# EAGLE board PT08ttl (EAGLE 6.6.0)
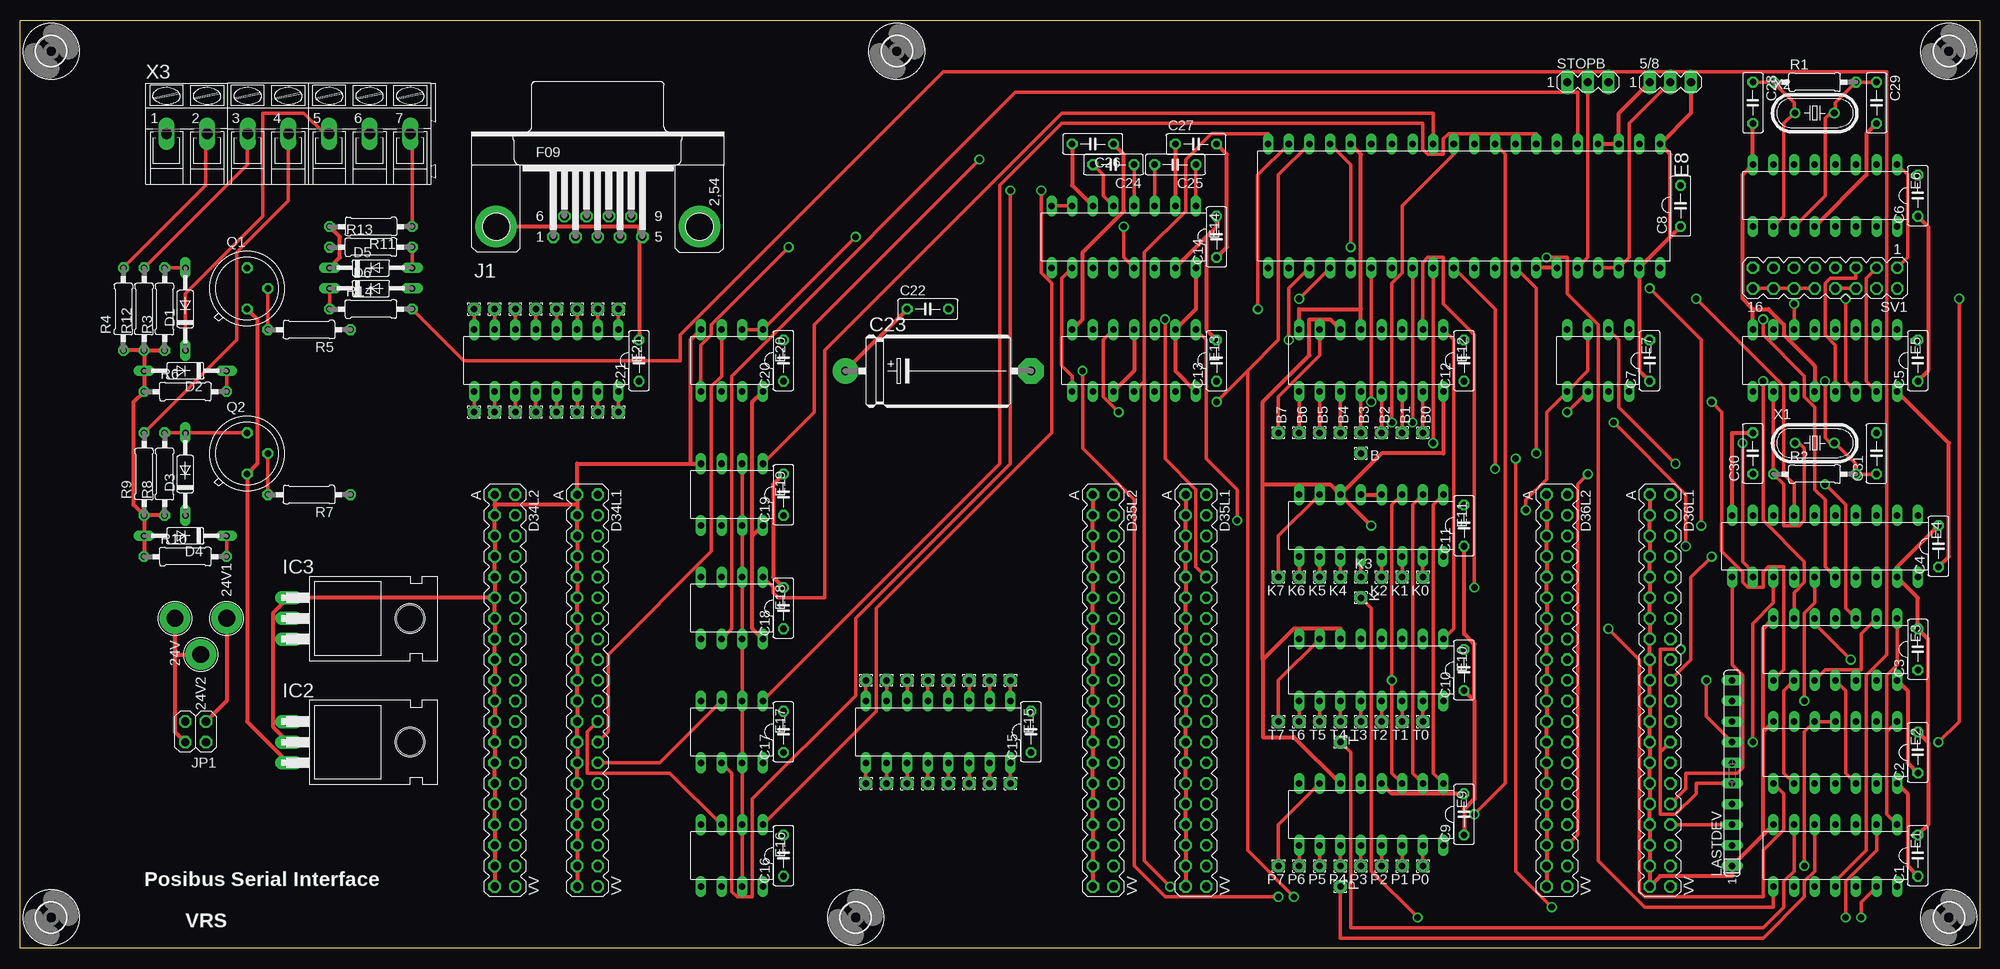
[diagram p3: board, top side]
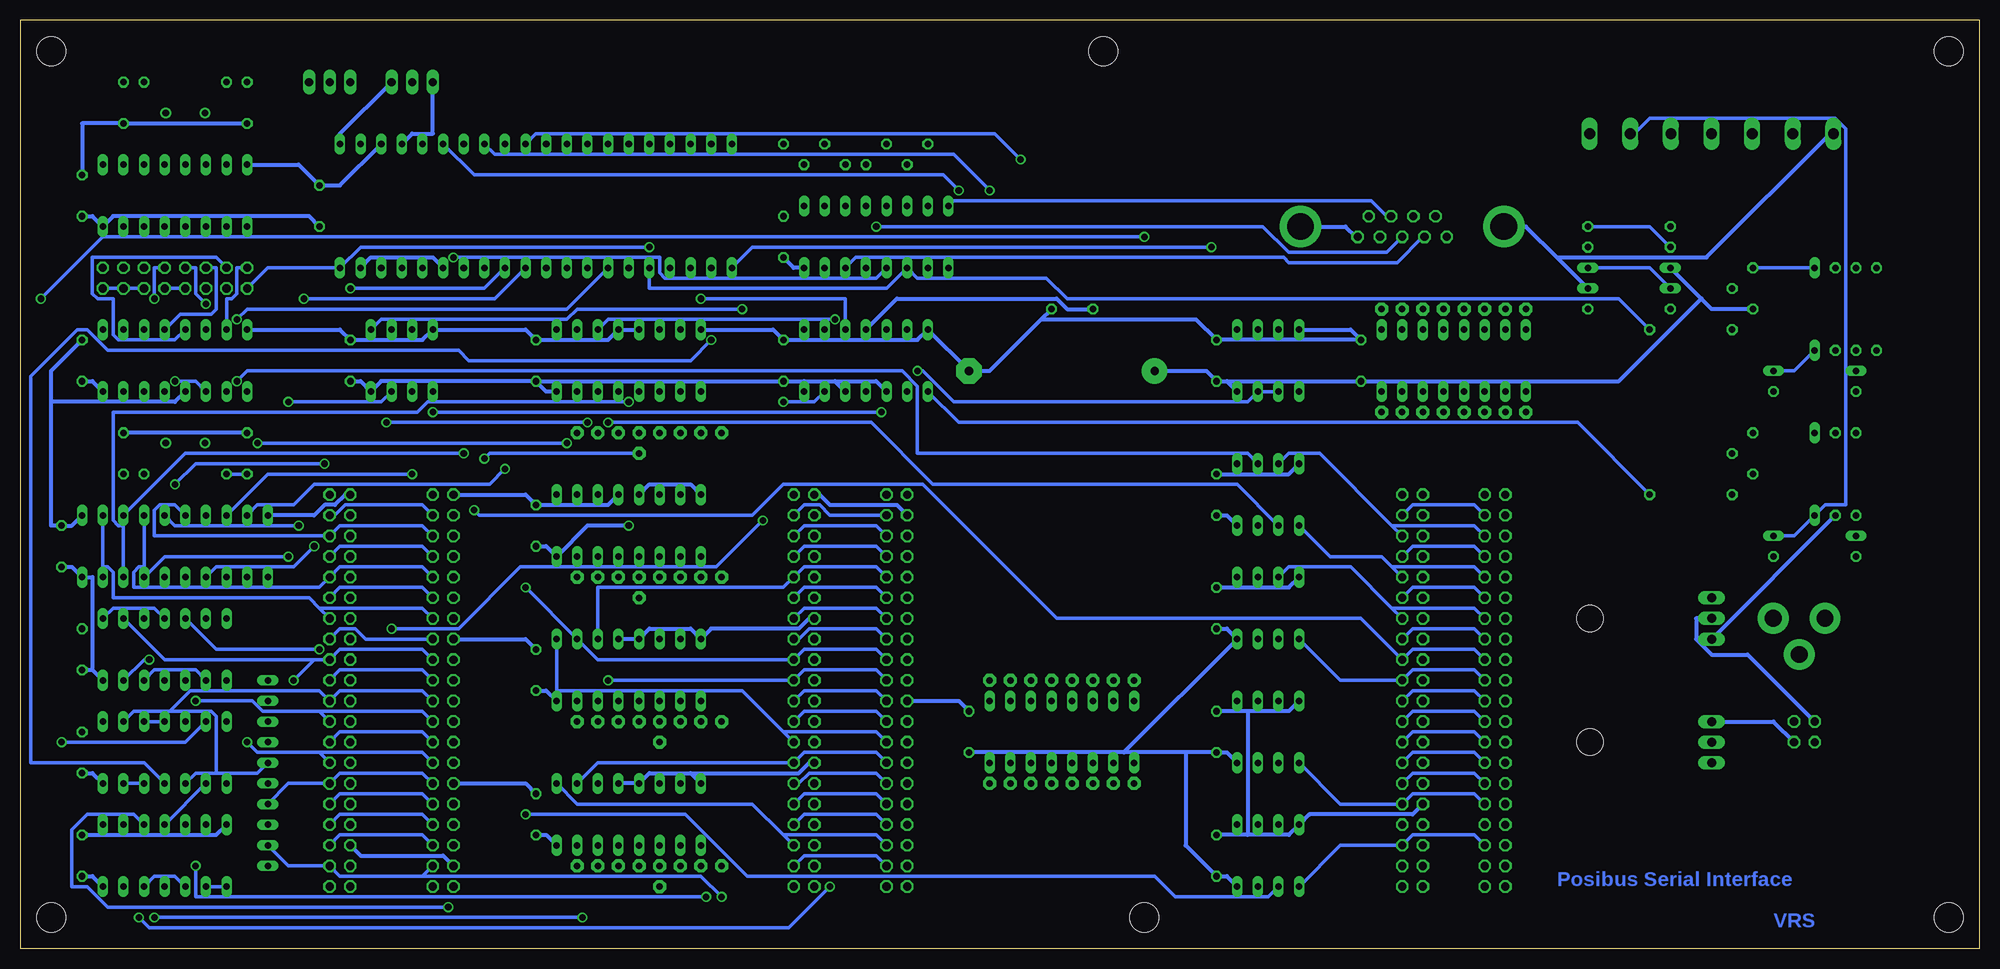
[diagram p4: board, bottom side, seen from below]

Size 241.3 x 114.3 mm. Coordinates in mm from the lower left corner, seen from the top.
Outline: 0,0 0,114.3 241.3,114.3 241.3,0 0,0
Copper layers (1+16): Top 0.035mm / dielectric 1.5mm / Bottom 0.035mm
Design rules "16mils": minimum track width 16mil, minimum drill 32mil, track to track 15mil, track to pad 10mil, pad to pad 10mil, via to via 10mil, smd to smd 10mil, copper to edge 13mil, drill to drill 10mil, minimum pad ring 10mil, minimum via ring 8mil, stop-mask expansion 0mil, vias tented up to drill 0mil, thermal gap 10mil
Net classes: 1 supply: width 0.508 mm

## Footprints (pad centres in the part's own frame; a part is rotated, then mirrored left to right if it is on the bottom)
MA03-1 = drill 1.016 long: 1 -2.54,0; 2 0,0; 3 2.54,0
0820 = drill 2.083 pad 3.81: P$1 0,0
1,6/0,8 = drill 0.813 pad 1.6 octagon: 1 0,0
C050-025X075 = drill 0.813 octagon: 1 -2.54,0; 2 2.54,0
E22-9 = drill 1.016 pad 3.15: + -11.43,0 | drill 1.016 pad 3.15 octagon: - 11.43,0
DO35-10 = drill 0.813 long: A 5.08,0; C -5.08,0
DEC40PINV = drill 1.016 octagon: A -24.13,-1.27; AA 3.81,-1.27; B -24.13,1.27; BB 3.81,1.27; C -21.59,-1.27; CC 6.35,-1.27; D -21.59,1.27; DD 6.35,1.27; E -19.05,-1.27; EE 8.89,-1.27; F -19.05,1.27; FF 8.89,1.27; H -16.51,-1.27; HH 11.43,-1.27; J -16.51,1.27; JJ 11.43,1.27; K -13.97,-1.27; KK 13.97,-1.27; L -13.97,1.27; LL 13.97,1.27; M -11.43,-1.27; MM 16.51,-1.27; N -11.43,1.27; NN 16.51,1.27; P -8.89,-1.27; PP 19.05,-1.27; R -8.89,1.27; RR 19.05,1.27; S -6.35,-1.27; SS 21.59,-1.27; T -6.35,1.27; TT 21.59,1.27; U -3.81,-1.27; UU 24.13,-1.27; V -3.81,1.27; VV 24.13,1.27; W -1.27,-1.27; X -1.27,1.27; Y 1.27,-1.27; Z 1.27,1.27
DIL14 = drill 0.813 long: 1 -7.62,-3.81; 2 -5.08,-3.81; 3 -2.54,-3.81; 4 0,-3.81; 5 2.54,-3.81; 6 5.08,-3.81; 7 7.62,-3.81; 8 7.62,3.81; 9 5.08,3.81; 10 2.54,3.81; 11 0,3.81; 12 -2.54,3.81; 13 -5.08,3.81; 14 -7.62,3.81
DIL20 = drill 0.813 long: 1 -11.43,-3.81; 2 -8.89,-3.81; 3 -6.35,-3.81; 4 -3.81,-3.81; 5 -1.27,-3.81; 6 1.27,-3.81; 7 3.81,-3.81; 8 6.35,-3.81; 9 8.89,-3.81; 10 11.43,-3.81; 11 11.43,3.81; 12 8.89,3.81; 13 6.35,3.81; 14 3.81,3.81; 15 1.27,3.81; 16 -1.27,3.81; 17 -3.81,3.81; 18 -6.35,3.81; 19 -8.89,3.81; 20 -11.43,3.81
DIL16 = drill 0.813 long: 1 -8.89,-3.81; 2 -6.35,-3.81; 3 -3.81,-3.81; 4 -1.27,-3.81; 5 1.27,-3.81; 6 3.81,-3.81; 7 6.35,-3.81; 8 8.89,-3.81; 9 8.89,3.81; 10 6.35,3.81; 11 3.81,3.81; 12 1.27,3.81; 13 -1.27,3.81; 14 -3.81,3.81; 15 -6.35,3.81; 16 -8.89,3.81
DIL08 = drill 0.813 long: 1 -3.81,-3.81; 2 -1.27,-3.81; 3 1.27,-3.81; 4 3.81,-3.81; 5 3.81,3.81; 6 1.27,3.81; 7 -1.27,3.81; 8 -3.81,3.81
DIL40 = drill 0.813 long: 1 -24.13,-7.62; 2 -21.59,-7.62; 3 -19.05,-7.62; 4 -16.51,-7.62; 5 -13.97,-7.62; 6 -11.43,-7.62; 7 -8.89,-7.62; 8 -6.35,-7.62; 9 -3.81,-7.62; 10 -1.27,-7.62; 11 1.27,-7.62; 12 3.81,-7.62; 13 6.35,-7.62; 14 8.89,-7.62; 15 11.43,-7.62; 16 13.97,-7.62; 17 16.51,-7.62; 18 19.05,-7.62; 19 21.59,-7.62; 20 24.13,-7.62; 21 24.13,7.62; 22 21.59,7.62; 23 19.05,7.62; 24 16.51,7.62; 25 13.97,7.62; 26 11.43,7.62; 27 8.89,7.62; 28 6.35,7.62; 29 3.81,7.62; 30 1.27,7.62; 31 -1.27,7.62; 32 -3.81,7.62; 33 -6.35,7.62; 34 -8.89,7.62; 35 -11.43,7.62; 36 -13.97,7.62; 37 -16.51,7.62; 38 -19.05,7.62; 39 -21.59,7.62; 40 -24.13,7.62
TO220H = drill 1.118 long: 1 -2.54,-10.16; 2 0,-10.16; 3 2.54,-10.16 | hole 3.302: 0,4.826
F09HP = drill 1.016 octagon: 1 -5.486,-1.27; 2 -2.743,-1.27; 3 0,-1.27; 4 2.743,-1.27; 5 5.486,-1.27; 6 -4.115,1.27; 7 -1.372,1.27; 8 1.372,1.27; 9 4.115,1.27 | drill 3.302 pad 5.08: G1 -12.522,0; G2 12.522,0
2X02 = drill 1.016 octagon: 1 -1.27,-1.27; 2 -1.27,1.27; 3 1.27,-1.27; 4 1.27,1.27
SIL10 = drill 0.813 long: 1 -11.43,0; 2 -8.89,0; 3 -6.35,0; 4 -3.81,0; 5 -1.27,0; 6 1.27,0; 7 3.81,0; 8 6.35,0; 9 8.89,0; 10 11.43,0
TO39 = drill 0.813 octagon: 1 0,-2.54; 2 2.54,0; 3 0,2.54
0207/10 = drill 0.813 octagon: 1 -5.08,0; 2 5.08,0
MA08-2 = drill 1.016 octagon: 1 -8.89,-1.27; 2 -8.89,1.27; 3 -6.35,-1.27; 4 -6.35,1.27; 5 -3.81,-1.27; 6 -3.81,1.27; 7 -1.27,-1.27; 8 -1.27,1.27; 9 1.27,-1.27; 10 1.27,1.27; 11 3.81,-1.27; 12 3.81,1.27; 13 6.35,-1.27; 14 6.35,1.27; 15 8.89,-1.27; 16 8.89,1.27
3,6 = hole 3.6: 0,0
HC49U-V = drill 0.813: 1 -2.413,0; 2 2.413,0
AK300/7 = drill 1.321 long: 1 -15.011,0; 2 -10.008,0; 3 -5.004,0; 4 0,0; 5 5.004,0; 6 10.008,0; 7 15.011,0

## Placement (x,y rotation side)
5/8  [MA03-1]  203.2,106.68 0 top
24V  PAD-0820  [0820]  19.05,40.64 270 top
24V1  PAD-0820  [0820]  25.4,40.64 90 top
24V2  PAD-0820  [0820]  22.23,36.2 270 top
B  [1,6/0,8]  165.1,60.96 270 top
B0  [1,6/0,8]  172.72,63.5 270 top
B1  [1,6/0,8]  170.18,63.5 270 top
B2  [1,6/0,8]  167.64,63.5 270 top
B3  [1,6/0,8]  165.1,63.5 270 top
B4  [1,6/0,8]  162.56,63.5 270 top
B5  [1,6/0,8]  160.02,63.5 270 top
B6  [1,6/0,8]  157.48,63.5 270 top
B7  [1,6/0,8]  154.94,63.5 270 top
C1  0.1  [C050-025X075]  233.68,11.43 90 top
C2  0.1  [C050-025X075]  233.68,24.13 90 top
C3  0.1  [C050-025X075]  233.68,36.83 90 top
C4  0.1  [C050-025X075]  236.22,49.53 90 top
C5  0.1  [C050-025X075]  233.68,72.39 90 top
C6  0.1  [C050-025X075]  233.68,92.71 90 top
C7  0.1  [C050-025X075]  200.66,72.39 90 top
C8  0.1  [C050-025X075]  204.47,91.44 90 top
C9  0.1  [C050-025X075]  177.8,16.51 90 top
C10  0.1  [C050-025X075]  177.8,34.29 90 top
C11  0.1  [C050-025X075]  177.8,52.07 90 top
C12  0.1  [C050-025X075]  177.8,72.39 90 top
C13  0.1  [C050-025X075]  147.32,72.39 90 top
C14  0.1  [C050-025X075]  147.32,87.63 90 top
C15  0.1  [C050-025X075]  124.46,26.67 90 top
C16  0.1  [C050-025X075]  93.98,11.43 90 top
C17  0.1  [C050-025X075]  93.98,26.67 90 top
C18  0.1  [C050-025X075]  93.98,41.91 90 top
C19  0.1  [C050-025X075]  93.98,55.88 90 top
C20  0.1  [C050-025X075]  93.98,72.39 90 top
C21  0.1  [C050-025X075]  76.2,72.39 90 top
C22  0.1  [C050-025X075]  111.76,78.74 0 top
C23  100uf  [E22-9]  113.03,71.12 0 top
C24  0.1  [C050-025X075]  134.62,96.52 180 top
C25  0.1  [C050-025X075]  142.24,96.52 180 top
C26  0.1  [C050-025X075]  132.08,99.06 180 top
C27  0.1  [C050-025X075]  144.78,99.06 0 top
C28  22pf  [C050-025X075]  213.36,104.14 270 top
C29  22pf  [C050-025X075]  228.6,104.14 270 top
C30  22pf  [C050-025X075]  213.36,60.96 90 top
C31  22pf  [C050-025X075]  228.6,60.96 90 top
D1  D664  [DO35-10]  20.32,78.74 90 top
D2  D664  [DO35-10]  20.32,71.12 180 top
D3  D664  [DO35-10]  20.32,58.42 90 top
D4  D664  [DO35-10]  20.32,50.8 180 top
D5  D664  [DO35-10]  43.18,83.82 0 top
D6  D664  [DO35-10]  43.18,81.28 0 top
D34L1  [DEC40PINV]  69.85,31.75 270 top
D34L2  [DEC40PINV]  59.69,31.75 270 top
D35L1  [DEC40PINV]  144.78,31.75 270 top
D35L2  [DEC40PINV]  133.35,31.75 270 top
D36L1  [DEC40PINV]  201.93,31.75 270 top
D36L2  [DEC40PINV]  189.23,31.75 270 top
E1  74LS02N  [DIL14]  223.52,11.43 180 top
E2  74LS00N  [DIL14]  223.52,24.13 180 top
E3  74LS08N  [DIL14]  223.52,36.83 180 top
E4  74LS240N  [DIL20]  222.25,49.53 180 top
E5  74HCT4060N  [DIL16]  222.25,72.39 180 top
E6  74HCT4060N  [DIL16]  222.25,92.71 180 top
E7  DS75452N  [DIL08]  194.31,72.39 180 top
E8  HD6402  [DIL40]  177.8,91.44 180 top
E9  74LS138N  [DIL16]  166.37,16.51 180 top
E10  74LS138N  [DIL16]  166.37,34.29 180 top
E11  74LS138N  [DIL16]  166.37,52.07 180 top
E12  74LS138N  [DIL16]  166.37,72.39 180 top
E13  74LS74N  [DIL14]  137.16,72.39 180 top
E14  MAX232  [DIL16]  135.89,87.63 180 top
E15  SPARE  [DIL16]  113.03,26.67 180 top
E16  DS75452N  [DIL08]  87.63,11.43 180 top
E17  DS75452N  [DIL08]  87.63,26.67 180 top
E18  DS75452N  [DIL08]  87.63,41.91 180 top
E19  DS75452N  [DIL08]  87.63,55.88 180 top
E20  DS75452N  [DIL08]  87.63,72.39 180 top
E21  SPARE  [DIL16]  64.77,72.39 180 top
IC2  7805T  [TO220H]  43.18,25.4 270 top
IC3  7915T  [TO220H]  43.18,40.64 270 top
J1  [F09HP]  71.12,88.9 0 top
JP1  [2X02]  21.59,26.67 180 top
K  [1,6/0,8]  165.1,43.18 270 top
K0  [1,6/0,8]  172.72,45.72 180 top
K1  [1,6/0,8]  170.18,45.72 180 top
K2  [1,6/0,8]  167.64,45.72 180 top
K3  [1,6/0,8]  165.1,45.72 0 top
K4  [1,6/0,8]  162.56,45.72 180 top
K5  [1,6/0,8]  160.02,45.72 180 top
K6  [1,6/0,8]  157.48,45.72 180 top
K7  [1,6/0,8]  154.94,45.72 180 top
LASTDEV  100  [SIL10]  210.82,21.59 90 top
P  [1,6/0,8]  162.56,7.62 270 top
P0  [1,6/0,8]  172.72,10.16 180 top
P1  [1,6/0,8]  170.18,10.16 180 top
P2  [1,6/0,8]  167.64,10.16 180 top
P3  [1,6/0,8]  165.1,10.16 180 top
P4  [1,6/0,8]  162.56,10.16 180 top
P5  [1,6/0,8]  160.02,10.16 180 top
P6  [1,6/0,8]  157.48,10.16 180 top
P7  [1,6/0,8]  154.94,10.16 180 top
PAD1  [1,6/0,8]  121.92,33.02 180 top
PAD2  [1,6/0,8]  119.38,33.02 180 top
PAD3  [1,6/0,8]  116.84,33.02 180 top
PAD4  [1,6/0,8]  114.3,33.02 180 top
PAD5  [1,6/0,8]  111.76,33.02 180 top
PAD6  [1,6/0,8]  109.22,33.02 180 top
PAD7  [1,6/0,8]  106.68,33.02 180 top
PAD8  [1,6/0,8]  104.14,33.02 180 top
PAD9  [1,6/0,8]  121.92,20.32 180 top
PAD18  [1,6/0,8]  73.66,78.74 180 top
PAD19  [1,6/0,8]  71.12,78.74 180 top
PAD28  [1,6/0,8]  68.58,78.74 180 top
PAD29  [1,6/0,8]  66.04,78.74 180 top
PAD30  [1,6/0,8]  63.5,78.74 180 top
PAD31  [1,6/0,8]  60.96,78.74 180 top
PAD32  [1,6/0,8]  58.42,78.74 180 top
PAD33  [1,6/0,8]  55.88,78.74 180 top
PAD34  [1,6/0,8]  73.66,66.04 180 top
PAD35  [1,6/0,8]  71.12,66.04 180 top
PAD36  [1,6/0,8]  68.58,66.04 180 top
PAD37  [1,6/0,8]  66.04,66.04 180 top
PAD38  [1,6/0,8]  63.5,66.04 180 top
PAD39  [1,6/0,8]  60.96,66.04 180 top
PAD40  [1,6/0,8]  58.42,66.04 180 top
PAD41  [1,6/0,8]  55.88,66.04 180 top
PAD42  [1,6/0,8]  119.38,20.32 180 top
PAD43  [1,6/0,8]  116.84,20.32 180 top
PAD44  [1,6/0,8]  114.3,20.32 180 top
PAD45  [1,6/0,8]  111.76,20.32 180 top
PAD46  [1,6/0,8]  109.22,20.32 180 top
PAD47  [1,6/0,8]  106.68,20.32 180 top
PAD48  [1,6/0,8]  104.14,20.32 180 top
Q1  2N2904  [TO39]  27.94,81.28 0 top
Q2  2N2904  [TO39]  27.94,60.96 0 top
R1  10M  [0207/10]  220.98,106.68 0 top
R2  10M  [0207/10]  220.98,58.42 0 top
R3  1.5K 1/2W  [0207/10]  17.78,78.74 90 top
R4  750 1W  [0207/10]  12.7,78.74 90 top
R5  470  [0207/10]  35.56,76.2 180 top
R6  15K 1/2W  [0207/10]  20.32,68.58 0 top
R7  470  [0207/10]  35.56,55.88 180 top
R8  1.5K 1/2W  [0207/10]  17.78,58.42 90 top
R9  750 1W  [0207/10]  15.24,58.42 90 top
R10  15K 1/2W  [0207/10]  20.32,48.26 0 top
R11  750 1/2W  [0207/10]  43.18,88.9 180 top
R12  560 1/2W  [0207/10]  15.24,78.74 90 top
R13  82  [0207/10]  43.18,86.36 0 top
R14  3.3K  [0207/10]  43.18,78.74 0 top
STOPB  [MA03-1]  193.04,106.68 0 top
SV1  [MA08-2]  222.25,82.55 180 top
T  [1,6/0,8]  162.56,25.4 270 top
T0  [1,6/0,8]  172.72,27.94 180 top
T1  [1,6/0,8]  170.18,27.94 180 top
T2  [1,6/0,8]  167.64,27.94 180 top
T3  [1,6/0,8]  165.1,27.94 180 top
T4  [1,6/0,8]  162.56,27.94 180 top
T5  [1,6/0,8]  160.02,27.94 180 top
T6  [1,6/0,8]  157.48,27.94 180 top
T7  [1,6/0,8]  154.94,27.94 180 top
U$1  [3,6]  237.49,3.81 0 top
U$2  [3,6]  237.49,110.49 0 top
U$3  [3,6]  3.81,110.49 0 top
U$4  [3,6]  3.81,3.81 0 top
U$5  [3,6]  107.95,110.49 0 top
U$6  [3,6]  102.87,3.81 0 top
X1  2.4576Mhz  [HC49U-V]  220.98,62.23 0 top
X2  3.579545Mhz  [HC49U-V]  220.98,102.87 0 top
X3  [AK300/7]  33.02,100.33 0 top

## Tracks (layer width: path | path; a pad name or v marks a point on that pad's centre or on a via)
24V1
  Top 0.508: JP1.1 25.4,30.48 24V1.P$1
24V2
  Top 0.508: JP1.4 19.05,26.67 19.05,36.2 | 24V.P$1 19.05,36.2 | 19.05,36.2 24V2.P$1
!ACB00
  Bottom 0.406: D34L2.D 62.23,54.61 69.85,54.61 D34L1.D
!ACB01
  Bottom 0.406: D34L2.J 62.23,49.53 69.85,49.53 D34L1.J
!ACB02
  Bottom 0.406: D34L2.N 62.23,44.45 69.85,44.45 D34L1.N
!ACB03
  Bottom 0.406: D34L2.T 62.23,39.37 69.85,39.37 D34L1.T
!ACB04
  Bottom 0.406: E18.5 78.74,33.02 D34L1.X 69.85,34.29 62.23,34.29 D34L2.X
!ACB05
  Top 0.406: E16.3 80.01,21.59 69.85,21.59 69.85,26.67 D34L1.BB
  Bottom 0.406: D34L2.BB 62.23,29.21 69.85,29.21 D34L1.BB
!ACB06
  Top 0.406: E17.3 78.74,22.86 D34L1.FF
  Bottom 0.406: D34L2.FF 62.23,24.13 69.85,24.13 D34L1.FF
!ACB07
  Bottom 0.406: E17.5 78.74,17.78 D34L1.LL 69.85,19.05 62.23,19.05 D34L2.LL
!ACB08
  Bottom 0.406: E16.5 78.74,12.7 D34L1.RR 69.85,13.97 62.23,13.97 D34L2.RR
!ACB09
  Bottom 0.406: E19.3 85.09,60.96 81.28,60.96 72.39,52.07 | D34L1.F 72.39,52.07 | D34L2.F 62.23,52.07 72.39,52.07
!ACB10
  Bottom 0.406: E19.5 80.01,48.26 73.66,48.26 72.39,46.99 | D34L1.L 72.39,46.99 | D34L2.L 62.23,46.99 72.39,46.99
!ACB11
  Bottom 0.406: E18.3 85.09,46.99 77.47,46.99 72.39,41.91 | D34L1.R 72.39,41.91 | D34L2.R 62.23,41.91 72.39,41.91
!ACCLEAR
  Top 0.406: E20.3 86.36,70.48 85.09,69.22 85.09,48.9 72.39,36.2 72.39,26.67 D34L1.DD
  Bottom 0.406: D34L2.DD 62.23,26.67 69.85,26.67 D34L1.DD
!B  (via drill 0.81)
  Top 0.406: v188.59,5.08 184.15,9.53 v184.15,60.33
  Bottom 0.406: E1.3 227.33,16.51 233.04,16.51 234.95,14.61 234.95,7.62 233.04,7.62 230.5,5.08 v188.59,5.08 | v184.15,60.33 183.51,60.96 B.1
!BINIT  (via drill 0.81)
  Top 0.406: v130.81,71.12 130.81,61.59 137.16,55.24 137.16,10.16 140.97,6.35 v154.94,6.35
  Bottom 0.406: E20.6 E20.7 90.17,67.31 126.36,67.31 130.18,71.12 v130.81,71.12 | LASTDEV.2 208.28,10.16 D36L1.TT 201.93,8.89 191.77,8.89 | 191.77,8.89 D36L2.TT | v154.94,6.35 157.48,8.89 191.77,8.89
!BMB03
  Bottom 0.406: D35L2.T 135.89,39.37 144.15,39.37 145.41,38.1 D35L1.T
!BMB04
  Bottom 0.406: D35L2.BB 135.89,29.21 144.78,29.21 D35L1.BB
!BMB05
  Bottom 0.406: D35L2.LL 135.89,19.05 144.78,19.05 D35L1.LL
!BMB06
  Bottom 0.406: D35L2.F 135.89,52.07 144.78,52.07 D35L1.F
!BMB07
  Bottom 0.406: D35L2.R 135.89,41.91 144.78,41.91 D35L1.R
!BMB08
  Bottom 0.406: D35L2.Z 135.89,31.75 144.78,31.75 D35L1.Z
!BRUN
  Bottom 0.406: D34L2.JJ 62.23,21.59 69.85,21.59 D34L1.JJ
!INT_RQ
  Bottom 0.406: D34L2.Z 62.23,31.75 69.85,31.75 D34L1.Z
!IOS  (via drill 0.81)
  Top 0.406: E7.3 193.04,71.12 E7.5 187.96,66.04 187.96,57.78 185.42,55.24 v185.42,53.98
  Bottom 0.406: D34L2.V 62.23,36.83 69.85,36.83 D34L1.V 76.2,40.64 113.67,40.64 130.18,57.15 147.32,57.15 151.13,53.34 184.78,53.34 v185.42,53.98
!K  (via drill 0.81)
  Top 0.406: E1.2 228.6,12.06 224.79,8.26 v224.79,3.81 | v172.09,3.81 166.37,9.53 166.37,41.91 K.1
  Bottom 0.406: v172.09,3.81 v224.79,3.81
!KCC  (via drill 0.81)
  Top 0.406: E2.4 E2.5 219.71,26.67 v219.71,10.16 | 151.13,71.12 154.94,74.93 154.94,95.25 E8.18 | 151.13,71.12 v147.32,67.31 | v156.84,6.35 151.13,12.06 151.13,71.12
  Bottom 0.406: E2.4 E2.3 | E13.13 143.51,67.31 v147.32,67.31 | v219.71,10.16 219.71,6.35 v156.84,6.35
!P
  Top 0.406: E1.5 220.98,9.53 219.71,8.26 219.71,6.35 214.63,1.27 162.56,1.27 P.1
!RXL
  Top 0.406: R14.2 54.61,72.39 81.28,72.39 81.28,75.56 113.67,107.95 229.87,107.95 229.87,36.2 227.33,33.66 227.33,12.06 223.52,8.26 E1.11
!T
  Top 0.406: E1.6 218.44,9.53 217.17,8.26 217.17,5.08 214.63,2.54 163.83,2.54 163.83,24.13 T.1
!TCF  (via drill 0.81)
  Top 0.406: E13.1 146.05,74.93 146.05,60.33 149.86,56.52 v149.86,52.7 | v195.58,39.37 199.39,35.56 199.39,6.99 200.03,6.35 214.63,6.35 214.63,12.06 217.17,14.61 217.17,19.05 E2.8
  Bottom 0.406: v149.86,52.7 155.57,46.99 179.71,46.99 187.32,39.37 v195.58,39.37
!TPC  (via drill 0.81)
  Top 0.406: E8.23 156.21,81.28 v156.21,74.93
  Bottom 0.406: v156.21,74.93 158.75,72.39 186.06,72.39 187.32,73.66 230.5,73.66 233.04,76.2 234.31,76.2 240.03,70.48 240.03,22.86 226.06,22.86 E2.11
+24V
  Bottom 0.508: JP1.2 25.4,27.94 IC2.1
-15V
  Top 0.508: R12.1 R4.1 | R12.1 R3.1 | R12.1 D2.A R6.1 13.97,67.31 13.97,54.61 R9.1 | R10.1 D4.A R9.1 | R8.1 R9.1
  Bottom 0.508: R8.1 IC3.3
-24V
  Bottom 0.508: JP1.3 28.57,36.2 33.02,36.2 34.92,38.1 34.92,40.64 IC3.2
B110
  Top 0.406: E6.1 232.41,95.25 232.41,85.09 SV1.1
B150
  Top 0.406: E5.15 227.33,69.85 227.33,82.55 SV1.3
B300
  Top 0.406: E5.13 223.52,74.3 222.25,75.56 222.25,81.92 222.88,82.55 226.06,82.55 SV1.5
B600  (via drill 0.81)
  Top 0.406: E5.14 224.79,69.85 v224.79,80.01
  Bottom 0.406: v224.79,80.01 224.79,83.82 SV1.7
B1200  (via drill 0.81)
  Top 0.406: v218.44,79.38 E5.6
  Bottom 0.406: v218.44,79.38 219.71,80.64 219.71,83.82 SV1.9
B2400
  Bottom 0.406: E5.4 221.62,78.11 217.81,78.11 217.17,78.74 217.17,83.82 SV1.11
B4800
  Bottom 0.406: E5.5 222.25,74.93 229.24,74.93 229.87,75.56 229.87,80.01 231.78,80.01 232.41,80.64 232.41,85.09 217.17,85.09 SV1.13
B9600
  Bottom 0.406: E5.7 215.9,80.01 215.26,80.01 214.63,80.64 214.63,83.82 SV1.15
BAC00
  Bottom 0.406: D36L2.D 191.77,54.61 201.29,54.61 202.56,53.34 D36L1.D
BAC01
  Bottom 0.406: D36L2.J 191.77,49.53 201.93,49.53 D36L1.J
BAC02
  Bottom 0.406: D36L2.N 191.77,44.45 201.93,44.45 D36L1.N
BAC03
  Bottom 0.406: D36L2.T 198.75,38.1 200.03,39.37 201.93,39.37 D36L1.T
BAC04  (via drill 0.81)
  Top 0.406: v208.28,48.26 205.74,45.72 205.74,35.56 D36L1.X
  Bottom 0.406: E4.17 223.52,48.26 v208.28,48.26 | D36L2.X 191.77,34.29 201.93,34.29 D36L1.X
BAC05  (via drill 0.81)
  Top 0.406: E4.15 220.98,42.55 219.71,41.27 v219.71,30.48
  Bottom 0.406: v219.71,30.48 212.72,30.48 211.46,29.21 204.47,29.21 | D36L1.BB 204.47,29.21 | D36L2.BB 191.77,29.21 204.47,29.21
BAC06  (via drill 0.81)
  Top 0.406: E4.13 215.9,42.55 213.36,40.01 v213.36,25.4
  Bottom 0.406: v213.36,25.4 212.09,24.13 204.47,24.13 | D36L1.FF 204.47,24.13 | D36L2.FF 191.77,24.13 204.47,24.13
BAC07
  Top 0.406: E4.11 210.82,34.92 212.09,33.66 212.09,22.23 211.46,21.59 205.1,21.59 205.1,19.68 D36L1.LL
  Bottom 0.406: D36L2.LL 191.77,19.05 201.93,19.05 D36L1.LL
BAC08  (via drill 0.81)
  Top 0.406: v193.04,58.42 191.77,57.15 191.77,13.97 D36L2.RR
  Bottom 0.406: E4.8 210.82,58.42 v193.04,58.42 | D36L1.RR 201.93,13.97 191.77,13.97 D36L2.RR
BAC09
  Bottom 0.406: E4.6 222.25,54.61 224.16,54.61 224.79,53.98 224.79,50.8 D36L1.F 201.93,52.07 191.77,52.07 D36L2.F
BAC10
  Bottom 0.406: E4.4 226.06,46.99 226.69,46.99 227.33,46.35 227.33,44.45 204.47,44.45 D36L1.L 201.93,46.99 191.77,46.99 D36L2.L
BAC11
  Bottom 0.406: E4.2 231.14,46.99 230.5,46.99 229.87,46.35 229.87,43.18 205.74,43.18 204.47,41.91 | D36L1.R 204.47,41.91 | D36L2.R 191.77,41.91 204.47,41.91
BCLK  (via drill 0.81)
  Top 0.406: SV1.16 SV1.14 SV1.12 SV1.10 | SV1.6 SV1.8 | E8.17 163.83,96.52 v163.83,86.36
  Bottom 0.406: SV1.6 SV1.4 SV1.2 | SV1.8 SV1.10 | v163.83,86.36 199.39,86.36 E8.40 210.82,83.82 SV1.16
BIOP1  (via drill 0.81)
  Top 0.406: E3.10 222.25,34.29 226.69,34.29 226.69,38.73 E3.2 | LASTDEV.7 207.65,28.57 v207.65,33.02
  Bottom 0.406: 205.1,35.56 v207.65,33.02 | 205.1,35.56 D36L1.V 201.93,36.83 191.77,36.83 D36L2.V | E3.2 223.52,35.56 205.1,35.56
BIOP2
  Bottom 0.406: D36L2.Z 191.77,31.75 201.93,31.75 D36L1.Z 204.47,31.75 220.34,31.75 222.88,29.21 | LASTDEV.6 212.09,21.59 217.17,21.59 | 217.17,21.59 219.71,21.59 E2.10 | E2.2 227.33,29.21 222.88,29.21 | 222.88,29.21 217.81,29.21 217.17,28.57 217.17,21.59
BIOP4  (via drill 0.81)
  Top 0.406: v225.43,35.56 220.98,40.01 E3.5 | LASTDEV.5 206.38,20.32 206.38,19.05 203.84,16.51 201.93,16.51 201.93,24.13 | D36L1.DD 201.93,24.13 | v204.47,36.83 201.93,36.83 201.93,24.13
  Bottom 0.406: E3.13 226.06,35.56 v225.43,35.56 | D36L2.DD 191.77,26.67 201.93,26.67 D36L1.DD | E3.5 217.17,36.83 v204.47,36.83
BMB00
  Bottom 0.406: D35L2.D 141.6,53.34 142.88,54.61 144.78,54.61 D35L1.D
BMB01
  Bottom 0.406: D35L2.J 135.89,49.53 144.78,49.53 D35L1.J
BMB02
  Bottom 0.406: D35L2.N 135.89,44.45 144.78,44.45 D35L1.N
BMB03  (via drill 0.81)
  Top 0.406: E9.3 168.91,21.59 v168.91,33.02 168.91,54.61 E11.3
  Bottom 0.406: D35L2.X 135.89,34.29 144.78,34.29 D35L1.X v168.91,33.02
BMB04
  Top 0.406: E11.2 171.45,54.61 171.45,21.59 E9.2
  Bottom 0.406: E9.2 170.18,22.86 D35L1.FF 144.78,24.13 135.89,24.13 D35L2.FF
BMB05
  Top 0.406: E11.1 173.99,54.61 173.99,21.59 E9.1
  Bottom 0.406: E9.1 172.72,17.78 151.13,17.78 147.32,13.97 | D35L1.RR 147.32,13.97 | D35L2.RR 135.89,13.97 147.32,13.97
BMB06  (via drill 0.81)
  Top 0.406: v140.97,77.47 140.97,60.33 144.78,56.52 144.78,46.99 D35L1.L
  Bottom 0.406: E10.3 170.18,44.45 147.32,44.45 D35L1.L 144.78,46.99 135.89,46.99 D35L2.L | E12.3 168.91,77.47 v140.97,77.47
BMB07  (via drill 0.81)
  Top 0.406: E12.2 172.72,84.45 173.35,85.09 175.26,85.09 175.26,79.38 179.07,75.56 v179.07,44.45
  Bottom 0.406: v179.07,44.45 E10.2 170.18,35.56 D35L1.V 144.78,36.83 135.89,36.83 D35L2.V
BMB08
  Top 0.406: E12.1 176.53,74.93 176.53,39.37 E10.1
  Bottom 0.406: E10.1 175.26,31.75 152.4,31.75 147.32,26.67 | D35L1.DD 147.32,26.67 | D35L2.DD 135.89,26.67 147.32,26.67
BMB09
  Bottom 0.406: D35L2.JJ 135.89,21.59 144.15,21.59 145.41,20.32 D35L1.JJ
BMB10
  Bottom 0.406: D35L2.NN 135.89,16.51 144.78,16.51 D35L1.NN
BMB11
  Bottom 0.406: D35L2.TT 135.89,11.43 144.78,11.43 D35L1.TT
BTS1
  Top 0.406: D36L1.NN LASTDEV.3
  Bottom 0.406: D36L2.NN 191.77,16.51 201.93,16.51 D36L1.NN
BTS3
  Bottom 0.406: LASTDEV.4 208.28,20.32 D36L1.JJ 201.93,21.59 191.77,21.59 D36L2.JJ
CS8
  Top 0.406: E8.37 E8.38 198.12,85.09 198.12,101.6 5/8.2
GND
  Top 0.508: IC2.2 31.11,27.3 31.11,41.27 IC3.1 D34L2.M | D34L2.A 58.42,54.61 | 58.42,54.61 D34L2.C D34L2.E D34L2.H D34L2.K D34L2.M | D34L2.UU D34L2.SS D34L2.PP D34L2.MM D34L2.KK D34L2.HH D34L2.EE D34L2.CC D34L2.AA D34L2.Y D34L2.W D34L2.U D34L2.S D34L2.P D34L2.M | 76.2,87.63 C21.2 | C18.2 92.71,45.72 92.71,57.15 C19.2 | 68.58,54.61 D34L1.A 68.58,59.69 82.55,59.69 | 68.58,54.61 D34L1.C D34L1.E D34L1.H D34L1.K D34L1.M D34L1.P D34L1.S D34L1.U D34L1.W D34L1.Y D34L1.AA D34L1.CC D34L1.EE D34L1.HH D34L1.KK D34L1.MM D34L1.PP D34L1.SS D34L1.UU | 82.55,59.69 E19.4 | E20.4 82.55,74.93 82.55,59.69 | J1.G1 76.2,88.9 76.2,87.63 | 76.2,87.63 J1.5 | 68.58,54.61 58.42,54.61 | D35L2.UU D35L2.SS D35L2.PP D35L2.MM D35L2.KK D35L2.HH D35L2.EE D35L2.CC D35L2.AA D35L2.Y D35L2.W D35L2.U D35L2.S D35L2.P D35L2.M D35L2.K D35L2.H D35L2.E D35L2.C D35L2.A | D35L1.A D35L1.C D35L1.E D35L1.H D35L1.K D35L1.M D35L1.P D35L1.S D35L1.U D35L1.W D35L1.Y D35L1.AA D35L1.CC D35L1.EE D35L1.HH D35L1.KK D35L1.MM D35L1.PP D35L1.SS D35L1.UU | E11.5 E11.4 | D36L2.A D36L2.C D36L2.E D36L2.H D36L2.K D36L2.M D36L2.P D36L2.S D36L2.U D36L2.W D36L2.Y D36L2.AA D36L2.CC D36L2.EE D36L2.HH D36L2.KK D36L2.MM D36L2.PP D36L2.SS D36L2.UU | E9.4 168.91,19.05 C9.2 | C30.2 210.82,63.5 E4.10 | D36L1.A D36L1.C D36L1.E D36L1.H D36L1.K D36L1.M D36L1.P D36L1.S D36L1.U D36L1.W D36L1.Y D36L1.AA D36L1.CC D36L1.EE D36L1.HH D36L1.KK D36L1.MM D36L1.PP D36L1.SS D36L1.UU 201.93,8.89 210.82,8.89 LASTDEV.1 214.63,13.97 | E1.7 214.63,13.97 | 214.63,26.67 E2.7 | 214.63,13.97 214.63,26.67 | E3.7 214.63,39.37 214.63,26.67 | C1.2 234.95,15.24 234.95,25.4
  Top 0.508: C2.2 234.95,25.4 | 234.95,25.4 234.95,38.1 C3.2 233.68,43.18 E4.19 231.14,46.99 C4.2 | E8.4 E8.3 196.85,102.87 5/8.1 | C28.2 E6.8 212.09,95.25 212.09,80.01 213.36,78.74 | E6.12 227.33,95.25 227.33,100.33 C29.2 | C26.1 135.89,97.79 135.89,90.81 130.81,85.72 130.81,77.47 E13.7 | E8.16 165.1,97.79 165.1,78.74 | E12.5 165.1,78.74 | 146.05,87.63 147.32,88.9 C14.2 | 146.05,87.63 E14.15 | C13.2 146.05,76.2 146.05,87.63 | 165.1,78.74 157.48,78.74 E12.8 | E5.12 220.98,71.75 217.17,75.56 217.17,76.83 215.26,78.74 213.36,78.74 | E5.8 213.36,78.74
  Bottom 0.508: 52.07,85.09 55.88,88.9 J1.G1 | 52.07,85.09 D6.A | 52.07,85.09 33.66,85.09 18.41,100.33 X3.1 | E20.4 77.47,76.2 C21.2 C20.2 96.52,77.47 115.57,77.47 | J1.G2 78.11,88.9 76.83,87.63 J1.5 | 90.17,13.97 85.09,13.97 E16.4 82.55,16.51 69.85,16.51 D34L1.KK | 90.17,13.97 C16.2 | 90.17,29.21 85.09,29.21 E17.4 | 90.17,29.21 C17.2 | 90.17,29.21 90.17,13.97 | E18.4 85.09,44.45 C18.2 | E19.4 85.09,58.42 C19.2 | C15.2 125.73,30.48 D35L2.Y | E10.4 E10.5 163.83,39.37 158.75,39.37 E10.8 156.21,39.37 145.41,39.37 144.15,40.64 D35L1.P | D35L2.C 133.35,54.61 141.6,54.61 142.88,55.88 D35L1.A | C10.2 179.07,38.1 D36L2.S | E11.8 158.75,57.15 163.83,57.15 E11.5 | D36L2.A 179.07,55.88 C11.2 168.91,54.61 E11.4 | 158.75,21.59 E9.8 | 158.75,21.59 163.83,21.59 E9.5 E9.4 | C9.2 179.07,20.32 D36L2.HH | E4.10 205.1,53.34 203.84,54.61 202.56,54.61 201.29,55.88 D36L1.A | C30.2 C31.2 | D36L2.SS 189.23,11.43 199.39,11.43 D36L1.PP | D35L1.EE 144.15,22.86 145.41,21.59 158.75,21.59 | E4.1 234.95,52.07 C4.2 237.49,52.07 237.49,67.31 | C5.2 237.49,71.12 237.49,67.31 | E1.7 217.17,13.97 C1.2 | STOPB.1 190.5,100.33 193.04,100.33 E8.4 | E6.8 207.01,96.52 C8.2 201.93,93.98 E8.3 | C6.2 233.68,101.6 C29.2 C28.2 | 115.57,77.47 121.92,71.12 C23.- E13.7 130.81,74.93 C13.2 148.59,76.2 E12.8 | 115.57,77.47 C22.2 | E12.5 E12.4 168.91,74.93 C12.2 179.07,76.2 E7.4 191.77,74.93 C7.2 201.93,76.2 E5.8 | 237.49,67.31 222.25,67.31 E5.12
KB
  Top 0.406: E1.1 229.87,16.51 229.87,26.67 | E2.1 229.87,26.67 | E3.1 231.14,34.92 229.87,33.66 229.87,26.67
  Bottom 0.406: E3.4 224.79,41.91 229.87,41.91 E3.1
KBF  (via drill 0.81)
  Top 0.406: E8.19 152.4,95.25 v152.4,78.74
  Bottom 0.406: v152.4,78.74 172.72,78.74 173.99,77.47 196.85,77.47 E7.1
KCC  (via drill 0.81)
  Top 0.406: E20.2 E20.1 v102.87,87.63 | v236.22,25.4 238.76,27.94 v238.76,80.01
  Bottom 0.406: E2.6 220.98,25.4 v236.22,25.4 | v238.76,80.01 231.14,87.63 v102.87,87.63
KRS  (via drill 0.81)
  Top 0.406: E16.7 E16.2 E17.7 E17.2 E18.7 E18.2 E19.7 E19.2 | E3.6 218.44,43.81 219.71,45.09 219.71,47.62 214.63,52.7 v214.63,69.85
  Bottom 0.406: v214.63,69.85 213.36,71.12 132.72,71.12 130.81,69.22 130.81,60.96 90.17,60.96 E19.2
KSF  (via drill 0.81)
  Top 0.406: E3.3 224.79,41.91 224.79,54.61 v222.25,57.15 | v203.84,59.69 196.85,66.67 196.85,74.93 E7.2
  Bottom 0.406: v222.25,57.15 219.71,59.69 v203.84,59.69
MR  (via drill 0.81)
  Top 0.406: E20.5 83.82,74.3 85.09,75.56 85.09,76.83 v94.61,86.36
  Bottom 0.406: v94.61,86.36 151.13,86.36 E8.21
N$1
  Top 0.406: B6.1 E12.9
N$2
  Top 0.406: PAD1.1 E15.1
N$3
  Top 0.406: PAD2.1 E15.2
N$4
  Top 0.406: PAD3.1 E15.3
N$5
  Top 0.406: B0.1 E12.15
N$6
  Top 0.406: B1.1 E12.14
N$7
  Top 0.406: B2.1 E12.13
N$8
  Top 0.406: B3.1 E12.12
N$9
  Top 0.406: B4.1 E12.11
N$10
  Top 0.406: B5.1 E12.10
N$11
  Top 0.406: E12.7 160.02,73.03 154.94,67.94 B7.1
N$12
  Top 0.406: PAD4.1 E15.4
N$13
  Top 0.406: C29.1 R1.2 223.52,104.14 223.52,102.87 X2.2 222.88,102.87 222.25,102.23 222.25,92.71 E6.11
N$14
  Top 0.406: C28.1 R1.1 218.44,104.14 218.44,102.87 | E6.10 217.17,90.17 217.17,101.6 218.44,102.87 | 218.44,102.87 X2.1
N$15
  Top 0.508: E14.6 129.54,93.98 C26.2
N$16
  Top 0.508: C27.1 E14.2
N$17
  Top 0.406: Q1.2 R5.2
N$18
  Top 0.406: D1.A R3.2
  Bottom 0.406: D1.A Q1.3
N$19
  Top 0.406: Q2.2 R7.2
N$20
  Top 0.406: R8.2 D3.A Q2.3
N$21
  Top 0.406: PAD5.1 E15.5
N$22
  Top 0.406: E14.5 133.35,92.71 133.35,95.25 C24.2
N$23
  Top 0.406: X1.1 219.07,62.23 219.71,61.59 219.71,52.7 219.07,52.07 217.17,52.07 217.17,57.15 R2.1 E5.10
  Bottom 0.406: R2.1 C30.1
N$24
  Top 0.406: D6.C R14.1 | R13.2 D5.A
  Bottom 0.406: D6.C 40.64,83.82 D5.A
N$25  (via drill 0.81)
  Top 0.406: C31.1 R2.2 226.06,59.69 223.52,62.23 X1.2 222.88,62.23 222.25,62.87 v222.25,69.85
  Bottom 0.406: E5.11 219.71,69.85 v222.25,69.85
N$27
  Bottom 0.406: E1.10 222.25,8.89 224.79,8.89 E1.12
N$31
  Top 0.406: PAD6.1 E15.6
N$32
  Top 0.406: C25.2 E14.3
N$33
  Top 0.406: PAD7.1 E15.7
N$34
  Top 0.406: PAD18.1 E21.1
N$35
  Top 0.406: PAD8.1 E15.8
N$37
  Top 0.406: PAD9.1 E15.16
N$38
  Top 0.406: PAD42.1 E15.15
N$39
  Top 0.406: PAD43.1 E15.14
N$40
  Top 0.406: PAD44.1 E15.13
N$41
  Top 0.406: PAD19.1 E21.2
N$42
  Top 0.406: PAD45.1 E15.12
N$43
  Top 0.406: PAD28.1 E21.3
N$44
  Top 0.406: C24.1 E14.4
N$45
  Top 0.406: C25.1 E14.1
N$46
  Top 0.406: PAD46.1 E15.11
N$47
  Top 0.406: PAD47.1 E15.10
N$48
  Top 0.406: PAD48.1 E15.9
N$49
  Top 0.406: T0.1 E10.15
N$50
  Top 0.406: PAD29.1 E21.4
N$51
  Top 0.406: PAD30.1 E21.5
N$52
  Top 0.406: PAD31.1 E21.6
N$53
  Top 0.406: PAD32.1 E21.7
N$54
  Top 0.406: PAD33.1 E21.8
N$55
  Top 0.406: PAD34.1 E21.16
N$56
  Top 0.406: PAD35.1 E21.15
N$57
  Top 0.406: PAD36.1 E21.14
N$58
  Top 0.406: PAD37.1 E21.13
N$59
  Top 0.406: PAD38.1 E21.12
N$61
  Top 0.406: PAD39.1 E21.11
N$68
  Top 0.406: PAD40.1 E21.10
N$69
  Top 0.406: PAD41.1 E21.9
N$90
  Top 0.406: K0.1 E11.15
N$91
  Top 0.406: K1.1 E11.14
N$97
  Top 0.406: K2.1 E11.13
N$109
  Top 0.406: K3.1 E11.12
N$112
  Top 0.406: K4.1 E11.11
N$113
  Top 0.406: K5.1 E11.10
N$114
  Top 0.406: E11.7 154.94,50.8 K7.1
N$115
  Top 0.406: K6.1 E11.9
N$116
  Top 0.406: T1.1 E10.14
N$117
  Top 0.406: T2.1 E10.13
N$118
  Top 0.406: T3.1 E10.12
N$119
  Top 0.406: T4.1 E10.11
N$120
  Top 0.406: T5.1 E10.10
N$121
  Top 0.406: E10.7 154.94,33.02 T7.1
N$122
  Top 0.406: T6.1 E10.9
N$123
  Top 0.406: P0.1 E9.15
N$124
  Top 0.406: P1.1 E9.14
N$125
  Top 0.406: P2.1 E9.13
N$126
  Top 0.406: P3.1 E9.12
N$127
  Top 0.406: P4.1 E9.11
N$128
  Top 0.406: P5.1 E9.10
N$129
  Top 0.406: E9.7 154.94,15.24 P7.1
N$130
  Top 0.406: P6.1 E9.9
PT
  Top 0.406: E3.9 217.17,31.75 217.17,21.59 E2.9
  Bottom 0.406: E3.9 219.71,34.29 224.79,34.29 E3.12 | E1.4 E2.9
RBR1
  Top 0.406: E18.1 92.71,44.45 92.71,43.81 93.34,43.18 99.06,43.18 99.06,73.66 128.27,102.87 173.99,102.87 E8.12
RBR2  (via drill 0.81)
  Top 0.406: v168.91,64.77 168.91,81.92 170.18,83.19 170.18,91.44 176.53,97.79 E8.11
  Bottom 0.406: E19.6 91.44,57.15 128.91,57.15 136.53,64.77 v168.91,64.77
RBR3  (via drill 0.81)
  Top 0.406: E19.1 97.79,66.04 97.79,76.83 v118.11,97.16
  Bottom 0.406: v118.11,97.16 121.28,100.33 177.8,100.33 E8.10
RBR4  (via drill 0.81)
  Top 0.406: v179.07,16.51 182.88,20.32 182.88,97.79 E8.9
  Bottom 0.406: E16.6 87.63,6.35 99.06,6.35 101.6,8.89 151.76,8.89 159.38,16.51 v179.07,16.51
RBR5  (via drill 0.81)
  Top 0.406: E17.6 87.63,21.59 87.63,6.99 88.27,6.35 90.17,6.35 90.17,18.41 102.87,31.11 102.87,40.64 121.92,59.69 v121.92,93.34
  Bottom 0.406: v121.92,93.34 126.36,97.79 182.88,97.79 E8.8
RBR6
  Top 0.406: E17.1 120.65,59.69 120.65,93.98 128.27,101.6 172.72,101.6 172.72,98.42 173.35,97.79 175.26,97.79 175.26,99.69 175.9,100.33 186.69,100.33 E8.7
RBR7  (via drill 0.81)
  Top 0.406: E16.1 105.41,29.21 105.41,41.91 127,63.5 127,81.92 125.73,83.19 v125.73,93.34
  Bottom 0.406: v125.73,93.34 127.64,95.25 185.42,95.25 E8.6
RBR8
  Top 0.406: E18.6 87.63,39.37 87.63,70.48 122.56,105.41 191.77,105.41 E8.5
RRUN
  Top 0.406: E14.10 128.27,82.55 128.27,71.75 129.54,70.48 E13.8
  Bottom 0.406: R7.1 49.53,64.77 125.73,64.77 E13.8
RRUN+
  Top 0.406: D4.C R10.2
  Bottom 0.406: D4.C 22.86,50.8 D3.C 19.05,54.61 16.51,54.61 16.51,100.97 17.78,102.23 40.64,102.23 42.55,100.33 X3.6
RRUN-
  Top 0.406: R9.2 26.67,74.93 26.67,85.72 33.02,92.08 X3.4
RTS
  Top 0.406: E14.7 E14.8
  Bottom 0.406: E14.8 126.36,92.08 74.93,92.08 73.03,90.17 J1.8
RX  (via drill 0.81)
  Top 0.406: 138.43,69.85 E13.11 | 138.43,69.85 138.43,85.72 143.51,90.81 143.51,97.16 146.69,100.33 153.67,100.33 E8.20 | E1.13 226.69,5.71 v226.69,3.81 | v141.6,7.62 138.43,10.79 138.43,69.85
  Bottom 0.406: v226.69,3.81 225.43,2.54 146.69,2.54 v141.6,7.62
RX+
  Top 0.406: R11.1 48.26,100.33 X3.7
  Bottom 0.406: R13.1 40.64,88.9 R11.1
RX-
  Top 0.406: R12.2 27.94,96.52 27.94,100.33 X3.3
RXD  (via drill 0.81)
  Top 0.406: E14.13 135.89,85.09 v135.89,88.9
  Bottom 0.406: v135.89,88.9 88.27,88.9 85.09,85.72 73.03,85.72 J1.3
RXE  (via drill 0.81)
  Top 0.406: v187.96,85.09 190.5,85.09 190.5,80.64 194.31,76.83 194.31,10.79 200.03,5.08 215.9,5.08 E1.8
  Bottom 0.406: E1.9 E1.8 | E14.12 135.89,82.55 161.93,82.55 162.56,83.19 162.56,85.09 v187.96,85.09
STOPB
  Top 0.406: E8.36 193.04,85.09 STOPB.2
TBR1  (via drill 0.81)
  Top 0.406: E8.26 v166.37,67.31
  Bottom 0.406: E4.18 228.6,52.07 229.24,52.07 229.87,52.7 229.87,66.04 192.41,66.04 191.13,67.31 v166.37,67.31
TBR2  (via drill 0.81)
  Top 0.406: E4.16 222.25,46.99 222.25,55.24 220.98,56.52 220.98,66.67 219.71,67.94 219.71,70.48 214.63,75.56 v214.63,77.47
  Bottom 0.406: v214.63,77.47 213.36,78.74 173.99,78.74 E8.27
TBR3  (via drill 0.81)
  Top 0.406: v171.45,64.77 E8.28 | v196.22,64.77 205.1,55.88 v205.1,49.53
  Bottom 0.406: v196.22,64.77 v171.45,64.77 | v205.1,49.53 207.65,46.99 217.17,46.99 E4.14
TBR4  (via drill 0.81)
  Top 0.406: v173.99,62.23 E8.29 | v212.09,62.23 212.09,47.62 213.36,46.35 E4.12
  Bottom 0.406: v212.09,62.23 v173.99,62.23
TBR5  (via drill 0.81)
  Top 0.406: E8.30 181.61,78.74 v181.61,59.05
  Bottom 0.406: v181.61,59.05 183.51,57.15 205.1,57.15 207.65,54.61 212.09,54.61 E4.9
TBR6  (via drill 0.81)
  Top 0.406: v206.38,80.01 217.17,69.22 217.17,58.42 218.44,57.15 E4.7
  Bottom 0.406: E8.31 182.88,80.01 v206.38,80.01
TBR7  (via drill 0.81)
  Top 0.406: v200.66,81.28 207.01,74.93 v207.01,52.07
  Bottom 0.406: E8.32 184.15,81.28 v200.66,81.28 | v207.01,52.07 222.25,52.07 E4.5
TBR8  (via drill 0.81)
  Top 0.406: E8.33 186.69,81.28 v186.69,60.96
  Bottom 0.406: v186.69,60.96 220.98,60.96 E4.3
TPC
  Top 0.406: E3.11 224.79,31.75 224.79,21.59 E2.12
  Bottom 0.406: E2.13 E2.12
TPF  (via drill 0.81)
  Top 0.406: v190.5,66.04 E7.6 | v135.25,66.04 133.35,67.94 133.35,74.93 E13.5
  Bottom 0.406: v135.25,66.04 v190.5,66.04
TRE  (via drill 0.81)
  Top 0.406: E8.24 v157.48,80.01
  Bottom 0.406: E13.3 139.7,80.01 v157.48,80.01
TSF  (via drill 0.81)
  Top 0.406: v208.28,67.31 209.55,66.04 209.55,48.9 212.09,46.35 212.09,45.09 212.72,44.45 214.63,44.45 214.63,46.35 215.26,46.99 217.17,46.99 217.17,34.29 E3.8
  Bottom 0.406: E7.7 196.85,67.31 v208.28,67.31
TX
  Bottom 0.406: R5.1 44.45,80.01 112.39,80.01 114.94,82.55 130.81,82.55 E14.11 134.62,81.28 163.83,81.28 E8.25
TX+
  Top 0.406: D2.C R6.2 | D1.C 20.32,80.64 29.84,90.17 29.84,102.87 34.92,102.87 37.47,100.33 X3.5
  Bottom 0.406: D1.C 22.86,71.12 D2.C
TX-
  Top 0.406: R4.2 22.86,93.98 22.86,100.33 X3.2
TXD
  Bottom 0.406: E14.14 138.43,85.09 85.72,85.09 85.09,84.45 71.75,84.45 68.58,87.63 J1.2
VCC  (via drill 0.81)
  Top 0.508: Q1.1 29.21,77.47 29.21,59.69 Q2.1 27.94,27.94 IC2.3 | R11.2 39.37,87.63 39.37,85.09 D5.C | C23.+ C22.1 | 90.17,50.8 E19.8 | 90.17,50.8 90.17,39.37 E18.8 | E20.8 90.17,67.31 90.17,50.8 | C5.1 234.95,71.12 234.95,88.9 C6.1 | C1.1 232.41,10.16 232.41,19.05 E2.14 | C2.1 232.41,22.86 232.41,31.75 E3.14 | E5.16 237.49,62.23 237.49,48.26 C4.1 | 5/8.3 205.74,102.87 E8.1 203.2,97.79 203.2,87.63 | E8.35 E8.34 | C8.1 203.2,87.63 | 203.2,87.63 E8.39 199.39,71.12 C7.1 | E13.10 137.16,71.12 E13.4 | E14.16 144.78,78.74 E13.2 142.24,71.12 E13.14 | C27.2 148.59,97.79 148.59,86.36 C14.1 | C9.1 177.8,17.14 179.07,18.41 179.07,30.48 | C10.1 179.07,30.48 | C11.1 177.8,38.73 179.07,37.47 179.07,30.48 | E11.6 167.64,60.96 175.26,60.96 E12.16 | E9.6 156.84,26.04 153.03,26.04 153.03,35.56 | 153.03,35.56 156.84,39.37 162.56,39.37 E10.6 | E12.6 161.29,77.47 158.75,77.47 158.75,73.03 153.03,67.31 153.03,57.15 | 153.03,35.56 153.03,57.15 | E11.6 161.29,57.15 153.03,57.15 | E11.6 v166.37,52.07
  Bottom 0.508: 34.29,80.01 33.02,78.74 Q1.1 | 34.29,80.01 D5.C | 92.71,69.85 E20.8 | 92.71,69.85 C20.1 95.25,71.12 C23.+ | 92.71,69.85 C21.1 44.45,69.85 34.29,80.01 | E19.8 92.71,53.34 C19.1 | C18.1 92.71,39.37 E18.8 105.41,24.13 | E16.8 92.71,8.89 C16.1 97.79,12.7 97.79,24.13 | E17.8 92.71,24.13 C17.1 97.79,24.13 | 97.79,24.13 105.41,24.13 | 105.41,24.13 C15.1 | E5.16 232.41,69.85 C5.1 | C6.1 232.41,90.17 E6.16 229.87,90.17 205.74,90.17 C8.1 | E1.14 232.41,8.89 C1.1 | E2.14 232.41,21.59 C2.1 | 232.41,34.29 E3.14 | C3.1 232.41,34.29 | C4.1 234.95,46.99 E4.20 232.41,45.72 232.41,34.29 | STOPB.3 201.93,100.33 E8.1 | C7.1 199.39,69.85 E7.8 196.85,69.85 C12.1 | E8.35 190.5,85.09 198.12,85.09 E8.39 | 140.97,69.85 E13.12 | 144.78,69.85 C13.1 C12.1 | 144.78,69.85 140.97,69.85 | 144.78,69.85 E13.14 | C14.1 146.05,83.82 E14.16 | E13.10 135.89,69.85 140.97,69.85 | C11.1 176.53,49.53 E11.16 171.45,52.07 v166.37,52.07 | E9.16 176.53,13.97 C9.1 | E10.16 176.53,31.75 C10.1 | C12.1 176.53,68.58 E12.16 | C22.1 112.39,78.74 113.67,80.01 133.35,80.01 E13.4

## Text on the board
Bottom: Posibus Serial Interface | VRS
tPlace: Posibus Serial Interface | VRS